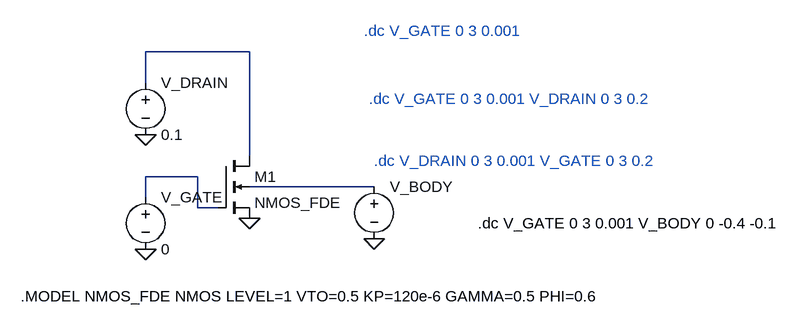
[diagram p0: schematic first_spice.asc]
first_spice.asc, the LTspice schematic file:
Version 4
SHEET 1 1064 680
WIRE 240 16 80 16
WIRE 80 64 80 16
WIRE 240 176 240 16
WIRE 160 208 80 208
WIRE 432 224 240 224
WIRE 80 240 80 208
WIRE 160 256 160 208
WIRE 192 256 160 256
FLAG 80 320 0
FLAG 80 144 0
FLAG 240 272 0
FLAG 432 304 0
SYMBOL nmos4 192 176 R0
SYMATTR InstName M1
SYMATTR Value NMOS_FDE
SYMATTR Value2 l=1u w=2u
SYMBOL voltage 80 48 R0
SYMATTR InstName V_DRAIN
SYMATTR Value 0.1
SYMATTR SpiceLine Rser=0
SYMBOL voltage 80 224 R0
SYMATTR InstName V_GATE
SYMATTR Value 0
SYMATTR SpiceLine Rser=0
SYMBOL voltage 432 208 R0
SYMATTR InstName V_BODY
SYMATTR Value ""
TEXT -112 392 Left 2 !.MODEL NMOS_FDE NMOS LEVEL=1 VTO=0.5 KP=120e-6 GAMMA=0.5 PHI=0.6
TEXT 416 -16 Left 2 ;.dc V_GATE 0 3 0.001
TEXT 424 88 Left 2 ;.dc V_GATE 0 3 0.001 V_DRAIN 0 3 0.2
TEXT 432 184 Left 2 ;.dc V_DRAIN 0 3 0.001 V_GATE 0 3 0.2
TEXT 592 280 Left 2 !.dc V_GATE 0 3 0.001 V_BODY 0 -0.4 -0.1

The netlist it stands for:
* first_spice.asc
M1 N001 N002 0 N003 NMOS_FDE l=1u w=2u
V_DRAIN N001 0 0.1 Rser=0
V_GATE N002 0 0 Rser=0
V_BODY N003 0
.model NMOS NMOS
.model PMOS PMOS
.lib standard.mos
.MODEL NMOS_FDE NMOS LEVEL=1 VTO=0.5 KP=120e-6 GAMMA=0.5 PHI=0.6
* .dc V_GATE 0 3 0.001
* .dc V_GATE 0 3 0.001 V_DRAIN 0 3 0.2
* .dc V_DRAIN 0 3 0.001 V_GATE 0 3 0.2
.dc V_GATE 0 3 0.001 V_BODY 0 -0.4 -0.1
.backanno
.end